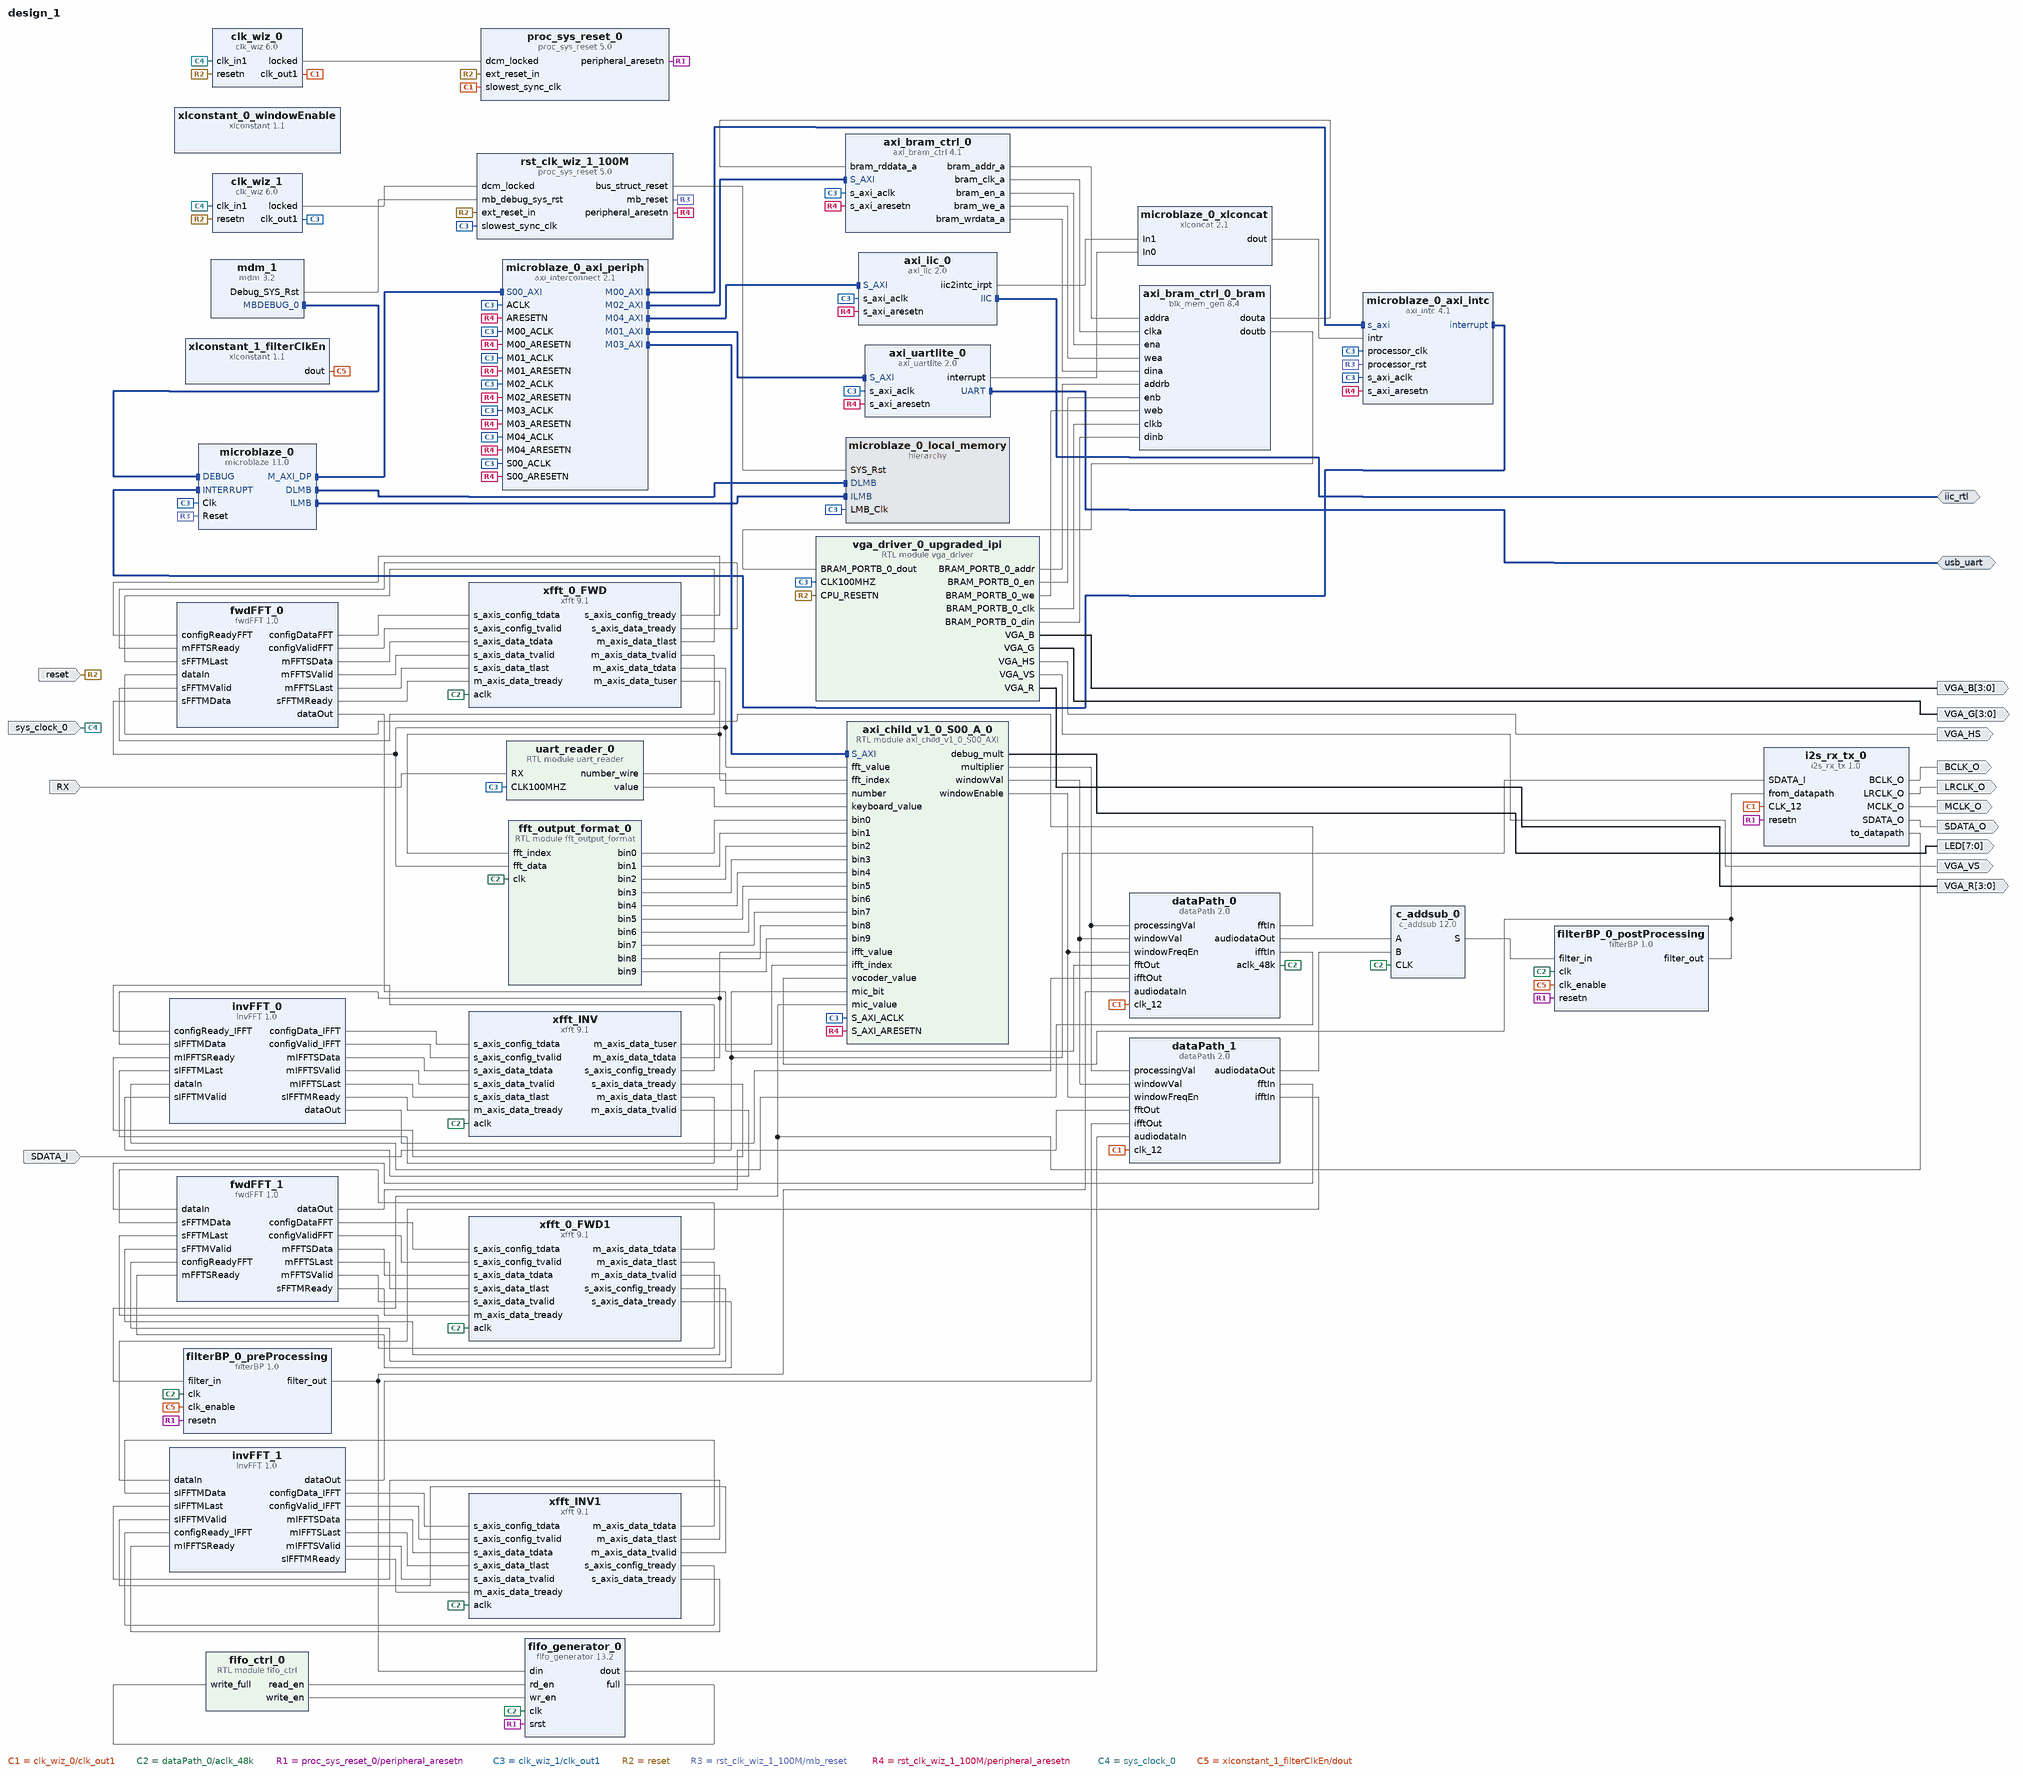
[diagram p0: block diagram of the top level]
# Vivado block design design_1, xc7a200tsbg484-1, Vivado 2018.3.1
create_bd_design design_1

create_bd_intf_port -mode Master -vlnv xilinx.com:interface:iic_rtl:1.0 iic_rtl
create_bd_intf_port -mode Master -vlnv xilinx.com:interface:uart_rtl:1.0 usb_uart
create_bd_port -dir O MCLK_O
create_bd_port -dir O LRCLK_O
create_bd_port -dir O BCLK_O
create_bd_port -dir O SDATA_O
create_bd_port -dir I SDATA_I
create_bd_port -dir O -from 7 -to 0 LED
create_bd_port -dir I RX
create_bd_port -dir O -from 3 -to 0 VGA_B
create_bd_port -dir O -from 3 -to 0 VGA_G
create_bd_port -dir O VGA_HS
create_bd_port -dir O -from 3 -to 0 VGA_R
create_bd_port -dir O VGA_VS
create_bd_port -dir I -type rst reset
set_property -dict {CONFIG.POLARITY ACTIVE_LOW} [get_bd_ports reset]
create_bd_port -dir I -type clk sys_clock_0
set_property -dict {CONFIG.FREQ_HZ 100000000 CONFIG.PHASE 0.000} [get_bd_ports sys_clock_0]

create_bd_cell -type ip -vlnv xilinx.com:ip:clk_wiz:6.0 clk_wiz_0
set_property -dict [list \
  CONFIG.CLKOUT1_JITTER 360.948 \
  CONFIG.CLKOUT1_PHASE_ERROR 301.601 \
  CONFIG.CLKOUT1_REQUESTED_OUT_FREQ 12.288 \
  CONFIG.MMCM_CLKFBOUT_MULT_F 48.000 \
  CONFIG.MMCM_CLKOUT0_DIVIDE_F 78.125 \
  CONFIG.MMCM_DIVCLK_DIVIDE 5 \
  CONFIG.RESET_PORT resetn \
  CONFIG.RESET_TYPE ACTIVE_LOW \
] [get_bd_cells clk_wiz_0]
create_bd_cell -type ip -vlnv xilinx.com:ip:proc_sys_reset:5.0 proc_sys_reset_0
create_bd_cell -type ip -vlnv xilinx.com:ip:xfft:9.1 xfft_0_FWD
set_property -dict [list \
  CONFIG.implementation_options pipelined_streaming_io \
  CONFIG.input_width 24 \
  CONFIG.number_of_stages_using_block_ram_for_data_and_phase_factors 3 \
  CONFIG.output_ordering natural_order \
  CONFIG.phase_factor_width 24 \
  CONFIG.scaling_options block_floating_point \
  CONFIG.target_clock_frequency 100 \
  CONFIG.transform_length 1024 \
  CONFIG.xk_index true \
] [get_bd_cells xfft_0_FWD]
create_bd_cell -type ip -vlnv xilinx.com:ip:xfft:9.1 xfft_INV
set_property -dict [list \
  CONFIG.implementation_options pipelined_streaming_io \
  CONFIG.input_width 24 \
  CONFIG.number_of_stages_using_block_ram_for_data_and_phase_factors 3 \
  CONFIG.output_ordering natural_order \
  CONFIG.phase_factor_width 24 \
  CONFIG.scaling_options block_floating_point \
  CONFIG.target_clock_frequency 100 \
  CONFIG.transform_length 1024 \
  CONFIG.xk_index true \
] [get_bd_cells xfft_INV]
create_bd_cell -type ip -vlnv utoronto.ca:user:i2s_rx_tx:1.0 i2s_rx_tx_0
create_bd_cell -type ip -vlnv utoronto.ca:user:fwdFFT:1.0 fwdFFT_0
create_bd_cell -type ip -vlnv utoronto.ca:user:invFFT:1.0 invFFT_0
create_bd_cell -type ip -vlnv xilinx.com:ip:axi_bram_ctrl:4.1 axi_bram_ctrl_0
set_property -dict {CONFIG.SINGLE_PORT_BRAM 1} [get_bd_cells axi_bram_ctrl_0]
create_bd_cell -type ip -vlnv xilinx.com:ip:blk_mem_gen:8.4 axi_bram_ctrl_0_bram
set_property -dict [list \
  CONFIG.EN_SAFETY_CKT true \
  CONFIG.Enable_32bit_Address true \
  CONFIG.Enable_B Use_ENB_Pin \
  CONFIG.Memory_Type True_Dual_Port_RAM \
  CONFIG.Operating_Mode_B WRITE_FIRST \
  CONFIG.Port_B_Clock 100 \
  CONFIG.Port_B_Enable_Rate 100 \
  CONFIG.Port_B_Write_Rate 50 \
  CONFIG.Read_Width_A 32 \
  CONFIG.Read_Width_B 32 \
  CONFIG.Register_PortA_Output_of_Memory_Primitives true \
  CONFIG.Register_PortB_Output_of_Memory_Primitives true \
  CONFIG.Use_RSTA_Pin true \
  CONFIG.Use_RSTB_Pin true \
  CONFIG.Write_Depth_A 80000 \
  CONFIG.Write_Width_A 32 \
  CONFIG.Write_Width_B 32 \
  CONFIG.use_bram_block Stand_Alone \
] [get_bd_cells axi_bram_ctrl_0_bram]
create_bd_cell -type ip -vlnv xilinx.com:ip:axi_iic:2.0 axi_iic_0
set_property -dict {CONFIG.IIC_BOARD_INTERFACE Custom CONFIG.USE_BOARD_FLOW true} [get_bd_cells axi_iic_0]
create_bd_cell -type ip -vlnv xilinx.com:ip:axi_uartlite:2.0 axi_uartlite_0
set_property -dict {CONFIG.UARTLITE_BOARD_INTERFACE Custom CONFIG.USE_BOARD_FLOW true} [get_bd_cells axi_uartlite_0]
create_bd_cell -type ip -vlnv xilinx.com:ip:clk_wiz:6.0 clk_wiz_1
set_property -dict {CONFIG.RESET_PORT resetn CONFIG.RESET_TYPE ACTIVE_LOW} [get_bd_cells clk_wiz_1]
create_bd_cell -type ip -vlnv xilinx.com:ip:mdm:3.2 mdm_1
create_bd_cell -type ip -vlnv xilinx.com:ip:microblaze:11.0 microblaze_0
set_property -dict {CONFIG.C_DEBUG_ENABLED 1 CONFIG.C_D_AXI 1 CONFIG.C_D_LMB 1 CONFIG.C_I_LMB 1} [get_bd_cells microblaze_0]
create_bd_cell -type ip -vlnv xilinx.com:ip:axi_intc:4.1 microblaze_0_axi_intc
set_property -dict {CONFIG.C_HAS_FAST 1} [get_bd_cells microblaze_0_axi_intc]
create_bd_cell -type ip -vlnv xilinx.com:ip:axi_interconnect:2.1 microblaze_0_axi_periph
set_property -dict {CONFIG.NUM_MI 5} [get_bd_cells microblaze_0_axi_periph]
create_bd_cell -type hier microblaze_0_local_memory
create_bd_cell -type ip -vlnv xilinx.com:ip:xlconcat:2.1 microblaze_0_xlconcat
set_property -dict {CONFIG.NUM_PORTS 2 CONFIG.dout_width 2} [get_bd_cells microblaze_0_xlconcat]
create_bd_cell -type ip -vlnv xilinx.com:ip:proc_sys_reset:5.0 rst_clk_wiz_1_100M
create_bd_cell -type module -reference uart_reader uart_reader_0
create_bd_cell -type module -reference vga_driver vga_driver_0_upgraded_ipi
create_bd_cell -type module -reference fft_output_format fft_output_format_0
create_bd_cell -type ip -vlnv xilinx.com:ip:xlconstant:1.1 xlconstant_0_windowEnable
set_property -dict {CONFIG.CONST_WIDTH 2} [get_bd_cells xlconstant_0_windowEnable]
create_bd_cell -type ip -vlnv xilinx.com:ip:xlconstant:1.1 xlconstant_1_filterClkEn
create_bd_cell -type ip -vlnv utoronto.ca:user:filterBP:1.0 filterBP_0_postProcessing
create_bd_cell -type ip -vlnv utoronto.ca:user:dataPath:2.0 dataPath_0
create_bd_cell -type module -reference axi_child_v1_0_S00_AXI axi_child_v1_0_S00_A_0
create_bd_cell -type ip -vlnv utoronto.ca:user:dataPath:2.0 dataPath_1
create_bd_cell -type ip -vlnv utoronto.ca:user:fwdFFT:1.0 fwdFFT_1
create_bd_cell -type ip -vlnv utoronto.ca:user:invFFT:1.0 invFFT_1
create_bd_cell -type ip -vlnv xilinx.com:ip:xfft:9.1 xfft_0_FWD1
set_property -dict [list \
  CONFIG.implementation_options pipelined_streaming_io \
  CONFIG.input_width 24 \
  CONFIG.number_of_stages_using_block_ram_for_data_and_phase_factors 3 \
  CONFIG.output_ordering natural_order \
  CONFIG.phase_factor_width 24 \
  CONFIG.scaling_options block_floating_point \
  CONFIG.target_clock_frequency 100 \
  CONFIG.transform_length 1024 \
  CONFIG.xk_index true \
] [get_bd_cells xfft_0_FWD1]
create_bd_cell -type ip -vlnv xilinx.com:ip:xfft:9.1 xfft_INV1
set_property -dict [list \
  CONFIG.implementation_options pipelined_streaming_io \
  CONFIG.input_width 24 \
  CONFIG.number_of_stages_using_block_ram_for_data_and_phase_factors 3 \
  CONFIG.output_ordering natural_order \
  CONFIG.phase_factor_width 24 \
  CONFIG.scaling_options block_floating_point \
  CONFIG.target_clock_frequency 100 \
  CONFIG.transform_length 1024 \
  CONFIG.xk_index true \
] [get_bd_cells xfft_INV1]
create_bd_cell -type ip -vlnv xilinx.com:ip:c_addsub:12.0 c_addsub_0
set_property -dict [list \
  CONFIG.A_Width 24 \
  CONFIG.B_Value 000000000000000000000000 \
  CONFIG.B_Width 24 \
  CONFIG.CE false \
  CONFIG.Latency 1 \
  CONFIG.Out_Width 24 \
] [get_bd_cells c_addsub_0]
create_bd_cell -type ip -vlnv xilinx.com:ip:fifo_generator:13.2 fifo_generator_0
set_property -dict {CONFIG.Input_Data_Width 24 CONFIG.Input_Depth 512 CONFIG.Output_Data_Width 24} [get_bd_cells fifo_generator_0]
create_bd_cell -type module -reference fifo_ctrl fifo_ctrl_0
create_bd_cell -type ip -vlnv utoronto.ca:user:filterBP:1.0 filterBP_0_preProcessing

# ---- hierarchy /microblaze_0_local_memory ----
current_bd_instance /microblaze_0_local_memory
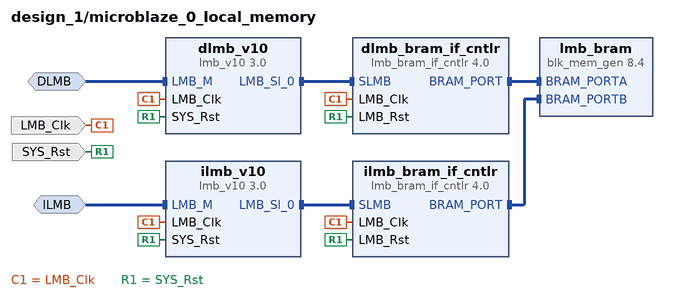
[diagram p1: block diagram inside /microblaze_0_local_memory]
create_bd_intf_pin -mode MirroredMaster -vlnv xilinx.com:interface:lmb_rtl:1.0 DLMB
create_bd_intf_pin -mode MirroredMaster -vlnv xilinx.com:interface:lmb_rtl:1.0 ILMB
create_bd_pin -dir I -type clk LMB_Clk
create_bd_pin -dir I -type rst SYS_Rst

create_bd_cell -type ip -vlnv xilinx.com:ip:lmb_bram_if_cntlr:4.0 dlmb_bram_if_cntlr
set_property -dict {CONFIG.C_ECC 0} [get_bd_cells dlmb_bram_if_cntlr]
create_bd_cell -type ip -vlnv xilinx.com:ip:lmb_v10:3.0 dlmb_v10
create_bd_cell -type ip -vlnv xilinx.com:ip:lmb_bram_if_cntlr:4.0 ilmb_bram_if_cntlr
set_property -dict {CONFIG.C_ECC 0} [get_bd_cells ilmb_bram_if_cntlr]
create_bd_cell -type ip -vlnv xilinx.com:ip:lmb_v10:3.0 ilmb_v10
create_bd_cell -type ip -vlnv xilinx.com:ip:blk_mem_gen:8.4 lmb_bram
set_property -dict [list \
  CONFIG.Enable_B Use_ENB_Pin \
  CONFIG.Memory_Type True_Dual_Port_RAM \
  CONFIG.Port_B_Clock 100 \
  CONFIG.Port_B_Enable_Rate 100 \
  CONFIG.Port_B_Write_Rate 50 \
  CONFIG.Use_RSTB_Pin true \
  CONFIG.use_bram_block BRAM_Controller \
] [get_bd_cells lmb_bram]

# ---- connections ----

current_bd_instance /microblaze_0_local_memory
connect_bd_intf_net -intf_net microblaze_0_dlmb [get_bd_intf_pins DLMB] [get_bd_intf_pins dlmb_v10/LMB_M]
connect_bd_intf_net -intf_net microblaze_0_dlmb_bus [get_bd_intf_pins dlmb_v10/LMB_Sl_0] [get_bd_intf_pins dlmb_bram_if_cntlr/SLMB]
connect_bd_intf_net -intf_net microblaze_0_dlmb_cntlr [get_bd_intf_pins dlmb_bram_if_cntlr/BRAM_PORT] [get_bd_intf_pins lmb_bram/BRAM_PORTA]
connect_bd_intf_net -intf_net microblaze_0_ilmb_cntlr [get_bd_intf_pins ilmb_bram_if_cntlr/BRAM_PORT] [get_bd_intf_pins lmb_bram/BRAM_PORTB]
connect_bd_intf_net -intf_net microblaze_0_ilmb_bus [get_bd_intf_pins ilmb_v10/LMB_Sl_0] [get_bd_intf_pins ilmb_bram_if_cntlr/SLMB]
connect_bd_intf_net -intf_net microblaze_0_ilmb [get_bd_intf_pins ILMB] [get_bd_intf_pins ilmb_v10/LMB_M]
connect_bd_net -net microblaze_0_Clk [get_bd_pins LMB_Clk] \
  [get_bd_pins dlmb_bram_if_cntlr/LMB_Clk] [get_bd_pins dlmb_v10/LMB_Clk] [get_bd_pins ilmb_bram_if_cntlr/LMB_Clk] \
  [get_bd_pins ilmb_v10/LMB_Clk]
connect_bd_net [get_bd_pins SYS_Rst] \
  [get_bd_pins dlmb_bram_if_cntlr/LMB_Rst] [get_bd_pins dlmb_v10/SYS_Rst] [get_bd_pins ilmb_bram_if_cntlr/LMB_Rst] \
  [get_bd_pins ilmb_v10/SYS_Rst]
set_property HDL_ATTRIBUTE.BMM_INFO_ADDRESS_SPACE {byte  0x00000000 32 > design_1 microblaze_0_local_memory/lmb_bram} [get_bd_cells dlmb_bram_if_cntlr]
set_property HDL_ATTRIBUTE.KEEP_HIERARCHY yes [get_bd_cells dlmb_bram_if_cntlr]

current_bd_instance /
connect_bd_intf_net [get_bd_intf_ports iic_rtl] [get_bd_intf_pins axi_iic_0/IIC]
connect_bd_intf_net [get_bd_intf_pins microblaze_0/DLMB] [get_bd_intf_pins microblaze_0_local_memory/DLMB]
connect_bd_intf_net -intf_net microblaze_0_intc_axi [get_bd_intf_pins microblaze_0_axi_periph/M00_AXI] [get_bd_intf_pins microblaze_0_axi_intc/s_axi]
connect_bd_intf_net [get_bd_intf_pins microblaze_0_axi_periph/M01_AXI] [get_bd_intf_pins axi_uartlite_0/S_AXI]
connect_bd_intf_net -intf_net microblaze_0_axi_dp [get_bd_intf_pins microblaze_0_axi_periph/S00_AXI] [get_bd_intf_pins microblaze_0/M_AXI_DP]
connect_bd_intf_net [get_bd_intf_pins microblaze_0_axi_periph/M02_AXI] [get_bd_intf_pins axi_bram_ctrl_0/S_AXI]
connect_bd_intf_net [get_bd_intf_pins mdm_1/MBDEBUG_0] [get_bd_intf_pins microblaze_0/DEBUG]
connect_bd_intf_net [get_bd_intf_pins microblaze_0_axi_intc/interrupt] [get_bd_intf_pins microblaze_0/INTERRUPT]
connect_bd_intf_net [get_bd_intf_pins microblaze_0/ILMB] [get_bd_intf_pins microblaze_0_local_memory/ILMB]
connect_bd_intf_net [get_bd_intf_pins microblaze_0_axi_periph/M04_AXI] [get_bd_intf_pins axi_iic_0/S_AXI]
connect_bd_intf_net [get_bd_intf_ports usb_uart] [get_bd_intf_pins axi_uartlite_0/UART]
connect_bd_intf_net [get_bd_intf_pins microblaze_0_axi_periph/M03_AXI] [get_bd_intf_pins axi_child_v1_0_S00_A_0/S_AXI]
connect_bd_net [get_bd_pins clk_wiz_0/clk_out1] \
  [get_bd_pins proc_sys_reset_0/slowest_sync_clk] [get_bd_pins i2s_rx_tx_0/CLK_12] [get_bd_pins dataPath_0/clk_12] \
  [get_bd_pins dataPath_1/clk_12]
connect_bd_net [get_bd_pins clk_wiz_0/locked] [get_bd_pins proc_sys_reset_0/dcm_locked]
connect_bd_net -net processingPath_0_axi_clk [get_bd_pins dataPath_0/aclk_48k] \
  [get_bd_pins xfft_0_FWD/aclk] [get_bd_pins xfft_INV/aclk] [get_bd_pins fft_output_format_0/clk] \
  [get_bd_pins filterBP_0_postProcessing/clk] [get_bd_pins xfft_0_FWD1/aclk] [get_bd_pins xfft_INV1/aclk] \
  [get_bd_pins c_addsub_0/CLK] [get_bd_pins fifo_generator_0/clk] [get_bd_pins filterBP_0_preProcessing/clk]
connect_bd_net [get_bd_pins proc_sys_reset_0/peripheral_aresetn] \
  [get_bd_pins i2s_rx_tx_0/resetn] [get_bd_pins filterBP_0_postProcessing/resetn] [get_bd_pins fifo_generator_0/srst] \
  [get_bd_pins filterBP_0_preProcessing/resetn]
connect_bd_net [get_bd_pins i2s_rx_tx_0/MCLK_O] [get_bd_ports MCLK_O]
connect_bd_net [get_bd_pins i2s_rx_tx_0/LRCLK_O] [get_bd_ports LRCLK_O]
connect_bd_net [get_bd_pins i2s_rx_tx_0/BCLK_O] [get_bd_ports BCLK_O]
connect_bd_net [get_bd_pins i2s_rx_tx_0/SDATA_O] [get_bd_ports SDATA_O]
connect_bd_net -net SDATA_I_0_1 [get_bd_ports SDATA_I] [get_bd_pins i2s_rx_tx_0/SDATA_I] [get_bd_pins axi_child_v1_0_S00_A_0/mic_bit]
connect_bd_net [get_bd_pins fwdFFT_0/configDataFFT] [get_bd_pins xfft_0_FWD/s_axis_config_tdata]
connect_bd_net [get_bd_pins fwdFFT_0/configValidFFT] [get_bd_pins xfft_0_FWD/s_axis_config_tvalid]
connect_bd_net -net xfft_0_s_axis_config_tready [get_bd_pins xfft_0_FWD/s_axis_config_tready] [get_bd_pins fwdFFT_0/configReadyFFT]
connect_bd_net [get_bd_pins fwdFFT_0/mFFTSData] [get_bd_pins xfft_0_FWD/s_axis_data_tdata]
connect_bd_net [get_bd_pins fwdFFT_0/mFFTSValid] [get_bd_pins xfft_0_FWD/s_axis_data_tvalid]
connect_bd_net [get_bd_pins fwdFFT_0/mFFTSLast] [get_bd_pins xfft_0_FWD/s_axis_data_tlast]
connect_bd_net -net xfft_0_s_axis_data_tready [get_bd_pins xfft_0_FWD/s_axis_data_tready] [get_bd_pins fwdFFT_0/mFFTSReady]
connect_bd_net -net xfft_0_m_axis_data_tdata [get_bd_pins xfft_0_FWD/m_axis_data_tdata] \
  [get_bd_pins fwdFFT_0/sFFTMData] [get_bd_pins fft_output_format_0/fft_data] [get_bd_pins axi_child_v1_0_S00_A_0/fft_value]
connect_bd_net -net xfft_0_m_axis_data_tlast [get_bd_pins xfft_0_FWD/m_axis_data_tlast] [get_bd_pins fwdFFT_0/sFFTMLast]
connect_bd_net [get_bd_pins fwdFFT_0/sFFTMReady] [get_bd_pins xfft_0_FWD/m_axis_data_tready]
connect_bd_net -net xfft_0_m_axis_data_tvalid [get_bd_pins xfft_0_FWD/m_axis_data_tvalid] [get_bd_pins fwdFFT_0/sFFTMValid]
connect_bd_net [get_bd_pins invFFT_0/configData_IFFT] [get_bd_pins xfft_INV/s_axis_config_tdata]
connect_bd_net [get_bd_pins invFFT_0/configValid_IFFT] [get_bd_pins xfft_INV/s_axis_config_tvalid]
connect_bd_net [get_bd_pins xfft_INV/s_axis_config_tready] [get_bd_pins invFFT_0/configReady_IFFT]
connect_bd_net [get_bd_pins xfft_INV/s_axis_data_tready] [get_bd_pins invFFT_0/mIFFTSReady]
connect_bd_net [get_bd_pins invFFT_0/mIFFTSData] [get_bd_pins xfft_INV/s_axis_data_tdata]
connect_bd_net [get_bd_pins invFFT_0/mIFFTSValid] [get_bd_pins xfft_INV/s_axis_data_tvalid]
connect_bd_net [get_bd_pins invFFT_0/mIFFTSLast] [get_bd_pins xfft_INV/s_axis_data_tlast]
connect_bd_net [get_bd_pins xfft_INV/m_axis_data_tdata] [get_bd_pins invFFT_0/sIFFTMData] [get_bd_pins axi_child_v1_0_S00_A_0/ifft_value]
connect_bd_net [get_bd_pins xfft_INV/m_axis_data_tlast] [get_bd_pins invFFT_0/sIFFTMLast]
connect_bd_net [get_bd_pins xfft_INV/m_axis_data_tvalid] [get_bd_pins invFFT_0/sIFFTMValid]
connect_bd_net [get_bd_pins invFFT_0/sIFFTMReady] [get_bd_pins xfft_INV/m_axis_data_tready]
connect_bd_net [get_bd_pins dataPath_0/fftIn] [get_bd_pins fwdFFT_0/dataIn]
connect_bd_net [get_bd_pins fwdFFT_0/dataOut] [get_bd_pins dataPath_0/fftOut]
connect_bd_net [get_bd_pins dataPath_0/ifftIn] [get_bd_pins invFFT_0/dataIn]
connect_bd_net [get_bd_pins invFFT_0/dataOut] [get_bd_pins dataPath_0/ifftOut]
connect_bd_net [get_bd_pins i2s_rx_tx_0/to_datapath] [get_bd_pins axi_child_v1_0_S00_A_0/mic_value] [get_bd_pins filterBP_0_preProcessing/filter_in]
connect_bd_net [get_bd_ports RX] [get_bd_pins uart_reader_0/RX]
connect_bd_net [get_bd_pins axi_bram_ctrl_0/bram_addr_a] [get_bd_pins axi_bram_ctrl_0_bram/addra]
connect_bd_net [get_bd_pins axi_bram_ctrl_0/bram_clk_a] [get_bd_pins axi_bram_ctrl_0_bram/clka]
connect_bd_net [get_bd_pins axi_bram_ctrl_0_bram/douta] [get_bd_pins axi_bram_ctrl_0/bram_rddata_a]
connect_bd_net [get_bd_pins axi_bram_ctrl_0_bram/doutb] [get_bd_pins vga_driver_0_upgraded_ipi/BRAM_PORTB_0_dout]
connect_bd_net [get_bd_pins axi_bram_ctrl_0/bram_en_a] [get_bd_pins axi_bram_ctrl_0_bram/ena]
connect_bd_net [get_bd_pins axi_bram_ctrl_0/bram_we_a] [get_bd_pins axi_bram_ctrl_0_bram/wea]
connect_bd_net [get_bd_pins axi_bram_ctrl_0/bram_wrdata_a] [get_bd_pins axi_bram_ctrl_0_bram/dina]
connect_bd_net [get_bd_pins axi_iic_0/iic2intc_irpt] [get_bd_pins microblaze_0_xlconcat/In1]
connect_bd_net [get_bd_pins axi_uartlite_0/interrupt] [get_bd_pins microblaze_0_xlconcat/In0]
connect_bd_net [get_bd_pins clk_wiz_1/locked] [get_bd_pins rst_clk_wiz_1_100M/dcm_locked]
connect_bd_net [get_bd_pins mdm_1/Debug_SYS_Rst] [get_bd_pins rst_clk_wiz_1_100M/mb_debug_sys_rst]
connect_bd_net -net microblaze_0_Clk [get_bd_pins clk_wiz_1/clk_out1] \
  [get_bd_pins microblaze_0_local_memory/LMB_Clk] [get_bd_pins microblaze_0/Clk] \
  [get_bd_pins microblaze_0_axi_intc/s_axi_aclk] [get_bd_pins microblaze_0_axi_intc/processor_clk] \
  [get_bd_pins microblaze_0_axi_periph/ACLK] [get_bd_pins microblaze_0_axi_periph/S00_ACLK] \
  [get_bd_pins microblaze_0_axi_periph/M00_ACLK] [get_bd_pins microblaze_0_axi_periph/M01_ACLK] \
  [get_bd_pins microblaze_0_axi_periph/M02_ACLK] [get_bd_pins microblaze_0_axi_periph/M03_ACLK] \
  [get_bd_pins uart_reader_0/CLK100MHZ] [get_bd_pins axi_bram_ctrl_0/s_axi_aclk] \
  [get_bd_pins microblaze_0_axi_periph/M04_ACLK] [get_bd_pins axi_iic_0/s_axi_aclk] [get_bd_pins axi_uartlite_0/s_axi_aclk] \
  [get_bd_pins rst_clk_wiz_1_100M/slowest_sync_clk] [get_bd_pins vga_driver_0_upgraded_ipi/CLK100MHZ] \
  [get_bd_pins axi_child_v1_0_S00_A_0/S_AXI_ACLK]
connect_bd_net -net microblaze_0_intr [get_bd_pins microblaze_0_xlconcat/dout] [get_bd_pins microblaze_0_axi_intc/intr]
connect_bd_net [get_bd_ports reset] \
  [get_bd_pins vga_driver_0_upgraded_ipi/CPU_RESETN] [get_bd_pins rst_clk_wiz_1_100M/ext_reset_in] \
  [get_bd_pins clk_wiz_1/resetn] [get_bd_pins clk_wiz_0/resetn] [get_bd_pins proc_sys_reset_0/ext_reset_in]
connect_bd_net [get_bd_pins rst_clk_wiz_1_100M/bus_struct_reset] [get_bd_pins microblaze_0_local_memory/SYS_Rst]
connect_bd_net [get_bd_pins rst_clk_wiz_1_100M/mb_reset] [get_bd_pins microblaze_0/Reset] [get_bd_pins microblaze_0_axi_intc/processor_rst]
connect_bd_net [get_bd_pins rst_clk_wiz_1_100M/peripheral_aresetn] \
  [get_bd_pins axi_bram_ctrl_0/s_axi_aresetn] [get_bd_pins microblaze_0_axi_intc/s_axi_aresetn] \
  [get_bd_pins microblaze_0_axi_periph/ARESETN] [get_bd_pins microblaze_0_axi_periph/S00_ARESETN] \
  [get_bd_pins microblaze_0_axi_periph/M00_ARESETN] [get_bd_pins microblaze_0_axi_periph/M01_ARESETN] \
  [get_bd_pins microblaze_0_axi_periph/M02_ARESETN] [get_bd_pins microblaze_0_axi_periph/M03_ARESETN] \
  [get_bd_pins microblaze_0_axi_periph/M04_ARESETN] [get_bd_pins axi_iic_0/s_axi_aresetn] \
  [get_bd_pins axi_uartlite_0/s_axi_aresetn] [get_bd_pins axi_child_v1_0_S00_A_0/S_AXI_ARESETN]
connect_bd_net -net sys_clock_0_1 [get_bd_ports sys_clock_0] [get_bd_pins clk_wiz_1/clk_in1] [get_bd_pins clk_wiz_0/clk_in1]
connect_bd_net [get_bd_pins uart_reader_0/number_wire] [get_bd_pins axi_child_v1_0_S00_A_0/number]
connect_bd_net [get_bd_pins uart_reader_0/value] [get_bd_pins axi_child_v1_0_S00_A_0/keyboard_value]
connect_bd_net -net vga_driver_0_VGA_B [get_bd_pins vga_driver_0_upgraded_ipi/VGA_B] [get_bd_ports VGA_B]
connect_bd_net -net vga_driver_0_VGA_G [get_bd_pins vga_driver_0_upgraded_ipi/VGA_G] [get_bd_ports VGA_G]
connect_bd_net -net vga_driver_0_VGA_HS [get_bd_pins vga_driver_0_upgraded_ipi/VGA_HS] [get_bd_ports VGA_HS]
connect_bd_net -net vga_driver_0_VGA_VS [get_bd_pins vga_driver_0_upgraded_ipi/VGA_VS] [get_bd_ports VGA_VS]
connect_bd_net -net vga_driver_0_bram_address [get_bd_pins vga_driver_0_upgraded_ipi/BRAM_PORTB_0_addr] [get_bd_pins axi_bram_ctrl_0_bram/addrb]
connect_bd_net -net vga_driver_0_bram_en [get_bd_pins vga_driver_0_upgraded_ipi/BRAM_PORTB_0_en] [get_bd_pins axi_bram_ctrl_0_bram/enb]
connect_bd_net -net vga_driver_0_bram_we [get_bd_pins vga_driver_0_upgraded_ipi/BRAM_PORTB_0_we] [get_bd_pins axi_bram_ctrl_0_bram/web]
connect_bd_net [get_bd_pins vga_driver_0_upgraded_ipi/BRAM_PORTB_0_clk] [get_bd_pins axi_bram_ctrl_0_bram/clkb]
connect_bd_net [get_bd_pins vga_driver_0_upgraded_ipi/BRAM_PORTB_0_din] [get_bd_pins axi_bram_ctrl_0_bram/dinb]
connect_bd_net [get_bd_pins vga_driver_0_upgraded_ipi/VGA_R] [get_bd_ports VGA_R]
connect_bd_net [get_bd_pins axi_child_v1_0_S00_A_0/multiplier] [get_bd_pins dataPath_0/processingVal] [get_bd_pins dataPath_1/processingVal]
connect_bd_net -net xfft_0_m_axis_data_tuser [get_bd_pins xfft_0_FWD/m_axis_data_tuser] \
  [get_bd_pins fft_output_format_0/fft_index] [get_bd_pins axi_child_v1_0_S00_A_0/fft_index]
connect_bd_net [get_bd_pins fft_output_format_0/bin0] [get_bd_pins axi_child_v1_0_S00_A_0/bin0]
connect_bd_net [get_bd_pins fft_output_format_0/bin1] [get_bd_pins axi_child_v1_0_S00_A_0/bin1]
connect_bd_net [get_bd_pins fft_output_format_0/bin2] [get_bd_pins axi_child_v1_0_S00_A_0/bin2]
connect_bd_net [get_bd_pins fft_output_format_0/bin3] [get_bd_pins axi_child_v1_0_S00_A_0/bin3]
connect_bd_net [get_bd_pins fft_output_format_0/bin4] [get_bd_pins axi_child_v1_0_S00_A_0/bin4]
connect_bd_net [get_bd_pins fft_output_format_0/bin5] [get_bd_pins axi_child_v1_0_S00_A_0/bin5]
connect_bd_net [get_bd_pins fft_output_format_0/bin6] [get_bd_pins axi_child_v1_0_S00_A_0/bin6]
connect_bd_net [get_bd_pins fft_output_format_0/bin7] [get_bd_pins axi_child_v1_0_S00_A_0/bin7]
connect_bd_net [get_bd_pins fft_output_format_0/bin8] [get_bd_pins axi_child_v1_0_S00_A_0/bin8]
connect_bd_net [get_bd_pins fft_output_format_0/bin9] [get_bd_pins axi_child_v1_0_S00_A_0/bin9]
connect_bd_net [get_bd_pins axi_child_v1_0_S00_A_0/debug_mult] [get_bd_ports LED]
connect_bd_net -net xlconstant_1_dout [get_bd_pins xlconstant_1_filterClkEn/dout] \
  [get_bd_pins filterBP_0_postProcessing/clk_enable] [get_bd_pins filterBP_0_preProcessing/clk_enable]
connect_bd_net -net filterBP_0_filter_out [get_bd_pins filterBP_0_postProcessing/filter_out] \
  [get_bd_pins i2s_rx_tx_0/from_datapath] [get_bd_pins axi_child_v1_0_S00_A_0/vocoder_value]
connect_bd_net [get_bd_pins axi_child_v1_0_S00_A_0/windowVal] [get_bd_pins dataPath_0/windowVal] [get_bd_pins dataPath_1/windowVal]
connect_bd_net [get_bd_pins axi_child_v1_0_S00_A_0/windowEnable] [get_bd_pins dataPath_0/windowFreqEn] [get_bd_pins dataPath_1/windowFreqEn]
connect_bd_net [get_bd_pins xfft_INV/m_axis_data_tuser] [get_bd_pins axi_child_v1_0_S00_A_0/ifft_index]
connect_bd_net -net dataPath_0_fftIn1 [get_bd_pins dataPath_1/fftIn] [get_bd_pins fwdFFT_1/dataIn]
connect_bd_net -net dataPath_0_ifftIn1 [get_bd_pins dataPath_1/ifftIn] [get_bd_pins invFFT_1/dataIn]
connect_bd_net -net fwdFFT_0_configDataFFT1 [get_bd_pins fwdFFT_1/configDataFFT] [get_bd_pins xfft_0_FWD1/s_axis_config_tdata]
connect_bd_net -net fwdFFT_0_configValidFFT1 [get_bd_pins fwdFFT_1/configValidFFT] [get_bd_pins xfft_0_FWD1/s_axis_config_tvalid]
connect_bd_net -net fwdFFT_0_dataOut1 [get_bd_pins fwdFFT_1/dataOut] [get_bd_pins dataPath_1/fftOut]
connect_bd_net -net fwdFFT_0_mFFTSData1 [get_bd_pins fwdFFT_1/mFFTSData] [get_bd_pins xfft_0_FWD1/s_axis_data_tdata]
connect_bd_net -net fwdFFT_0_mFFTSLast1 [get_bd_pins fwdFFT_1/mFFTSLast] [get_bd_pins xfft_0_FWD1/s_axis_data_tlast]
connect_bd_net -net fwdFFT_0_mFFTSValid1 [get_bd_pins fwdFFT_1/mFFTSValid] [get_bd_pins xfft_0_FWD1/s_axis_data_tvalid]
connect_bd_net -net fwdFFT_0_sFFTMReady1 [get_bd_pins fwdFFT_1/sFFTMReady] [get_bd_pins xfft_0_FWD1/m_axis_data_tready]
connect_bd_net -net invFFT_0_configData_IFFT1 [get_bd_pins invFFT_1/configData_IFFT] [get_bd_pins xfft_INV1/s_axis_config_tdata]
connect_bd_net -net invFFT_0_configValid_IFFT1 [get_bd_pins invFFT_1/configValid_IFFT] [get_bd_pins xfft_INV1/s_axis_config_tvalid]
connect_bd_net -net invFFT_0_dataOut1 [get_bd_pins invFFT_1/dataOut] [get_bd_pins dataPath_1/ifftOut]
connect_bd_net -net invFFT_0_mIFFTSData1 [get_bd_pins invFFT_1/mIFFTSData] [get_bd_pins xfft_INV1/s_axis_data_tdata]
connect_bd_net -net invFFT_0_mIFFTSLast1 [get_bd_pins invFFT_1/mIFFTSLast] [get_bd_pins xfft_INV1/s_axis_data_tlast]
connect_bd_net -net invFFT_0_mIFFTSValid1 [get_bd_pins invFFT_1/mIFFTSValid] [get_bd_pins xfft_INV1/s_axis_data_tvalid]
connect_bd_net -net invFFT_0_sIFFTMReady1 [get_bd_pins invFFT_1/sIFFTMReady] [get_bd_pins xfft_INV1/m_axis_data_tready]
connect_bd_net -net xfft_0_m_axis_data_tdata1 [get_bd_pins xfft_0_FWD1/m_axis_data_tdata] [get_bd_pins fwdFFT_1/sFFTMData]
connect_bd_net -net xfft_0_m_axis_data_tlast1 [get_bd_pins xfft_0_FWD1/m_axis_data_tlast] [get_bd_pins fwdFFT_1/sFFTMLast]
connect_bd_net -net xfft_0_m_axis_data_tvalid1 [get_bd_pins xfft_0_FWD1/m_axis_data_tvalid] [get_bd_pins fwdFFT_1/sFFTMValid]
connect_bd_net -net xfft_0_s_axis_config_tready1 [get_bd_pins xfft_0_FWD1/s_axis_config_tready] [get_bd_pins fwdFFT_1/configReadyFFT]
connect_bd_net -net xfft_0_s_axis_data_tready1 [get_bd_pins xfft_0_FWD1/s_axis_data_tready] [get_bd_pins fwdFFT_1/mFFTSReady]
connect_bd_net -net xfft_INV_m_axis_data_tdata1 [get_bd_pins xfft_INV1/m_axis_data_tdata] [get_bd_pins invFFT_1/sIFFTMData]
connect_bd_net -net xfft_INV_m_axis_data_tlast1 [get_bd_pins xfft_INV1/m_axis_data_tlast] [get_bd_pins invFFT_1/sIFFTMLast]
connect_bd_net -net xfft_INV_m_axis_data_tvalid1 [get_bd_pins xfft_INV1/m_axis_data_tvalid] [get_bd_pins invFFT_1/sIFFTMValid]
connect_bd_net -net xfft_INV_s_axis_config_tready1 [get_bd_pins xfft_INV1/s_axis_config_tready] [get_bd_pins invFFT_1/configReady_IFFT]
connect_bd_net -net xfft_INV_s_axis_data_tready1 [get_bd_pins xfft_INV1/s_axis_data_tready] [get_bd_pins invFFT_1/mIFFTSReady]
connect_bd_net [get_bd_pins dataPath_1/audiodataOut] [get_bd_pins c_addsub_0/B]
connect_bd_net [get_bd_pins dataPath_0/audiodataOut] [get_bd_pins c_addsub_0/A]
connect_bd_net [get_bd_pins c_addsub_0/S] [get_bd_pins filterBP_0_postProcessing/filter_in]
connect_bd_net [get_bd_pins fifo_ctrl_0/read_en] [get_bd_pins fifo_generator_0/rd_en]
connect_bd_net [get_bd_pins fifo_ctrl_0/write_en] [get_bd_pins fifo_generator_0/wr_en]
connect_bd_net [get_bd_pins fifo_generator_0/full] [get_bd_pins fifo_ctrl_0/write_full]
connect_bd_net [get_bd_pins fifo_generator_0/dout] [get_bd_pins dataPath_1/audiodataIn]
connect_bd_net [get_bd_pins filterBP_0_preProcessing/filter_out] [get_bd_pins fifo_generator_0/din] [get_bd_pins dataPath_0/audiodataIn]
set_property HDL_ATTRIBUTE.BMM_INFO_ADDRESS_SPACE {byte  0xC0000000 32 > design_1 axi_bram_ctrl_0_bram} [get_bd_cells axi_bram_ctrl_0]
set_property HDL_ATTRIBUTE.KEEP_HIERARCHY yes [get_bd_cells axi_bram_ctrl_0]
set_property HDL_ATTRIBUTE.BMM_INFO_PROCESSOR {microblaze-le > design_1 microblaze_0_local_memory/dlmb_bram_if_cntlr} [get_bd_cells microblaze_0]
set_property HDL_ATTRIBUTE.KEEP_HIERARCHY yes [get_bd_cells microblaze_0]

# ---- address map ----
assign_bd_address -offset 0x00000000 -range 128K -target_address_space [get_bd_addr_spaces microblaze_0/Data] [get_bd_addr_segs microblaze_0_local_memory/dlmb_bram_if_cntlr/SLMB/Mem]
assign_bd_address -offset 0x40600000 -range 64K -target_address_space [get_bd_addr_spaces microblaze_0/Data] [get_bd_addr_segs axi_uartlite_0/S_AXI/Reg]
assign_bd_address -offset 0x40800000 -range 64K -target_address_space [get_bd_addr_spaces microblaze_0/Data] [get_bd_addr_segs axi_iic_0/S_AXI/Reg]
assign_bd_address -offset 0x41200000 -range 128K -target_address_space [get_bd_addr_spaces microblaze_0/Data] [get_bd_addr_segs microblaze_0_axi_intc/S_AXI/Reg]
assign_bd_address -offset 0x44A00000 -range 64K -target_address_space [get_bd_addr_spaces microblaze_0/Data] [get_bd_addr_segs axi_child_v1_0_S00_A_0/S_AXI/reg0]
assign_bd_address -offset 0xC0000000 -range 2M -target_address_space [get_bd_addr_spaces microblaze_0/Data] [get_bd_addr_segs axi_bram_ctrl_0/S_AXI/Mem0]
assign_bd_address -offset 0x00000000 -range 128K -target_address_space [get_bd_addr_spaces microblaze_0/Instruction] [get_bd_addr_segs microblaze_0_local_memory/ilmb_bram_if_cntlr/SLMB/Mem]

validate_bd_design
save_bd_design
